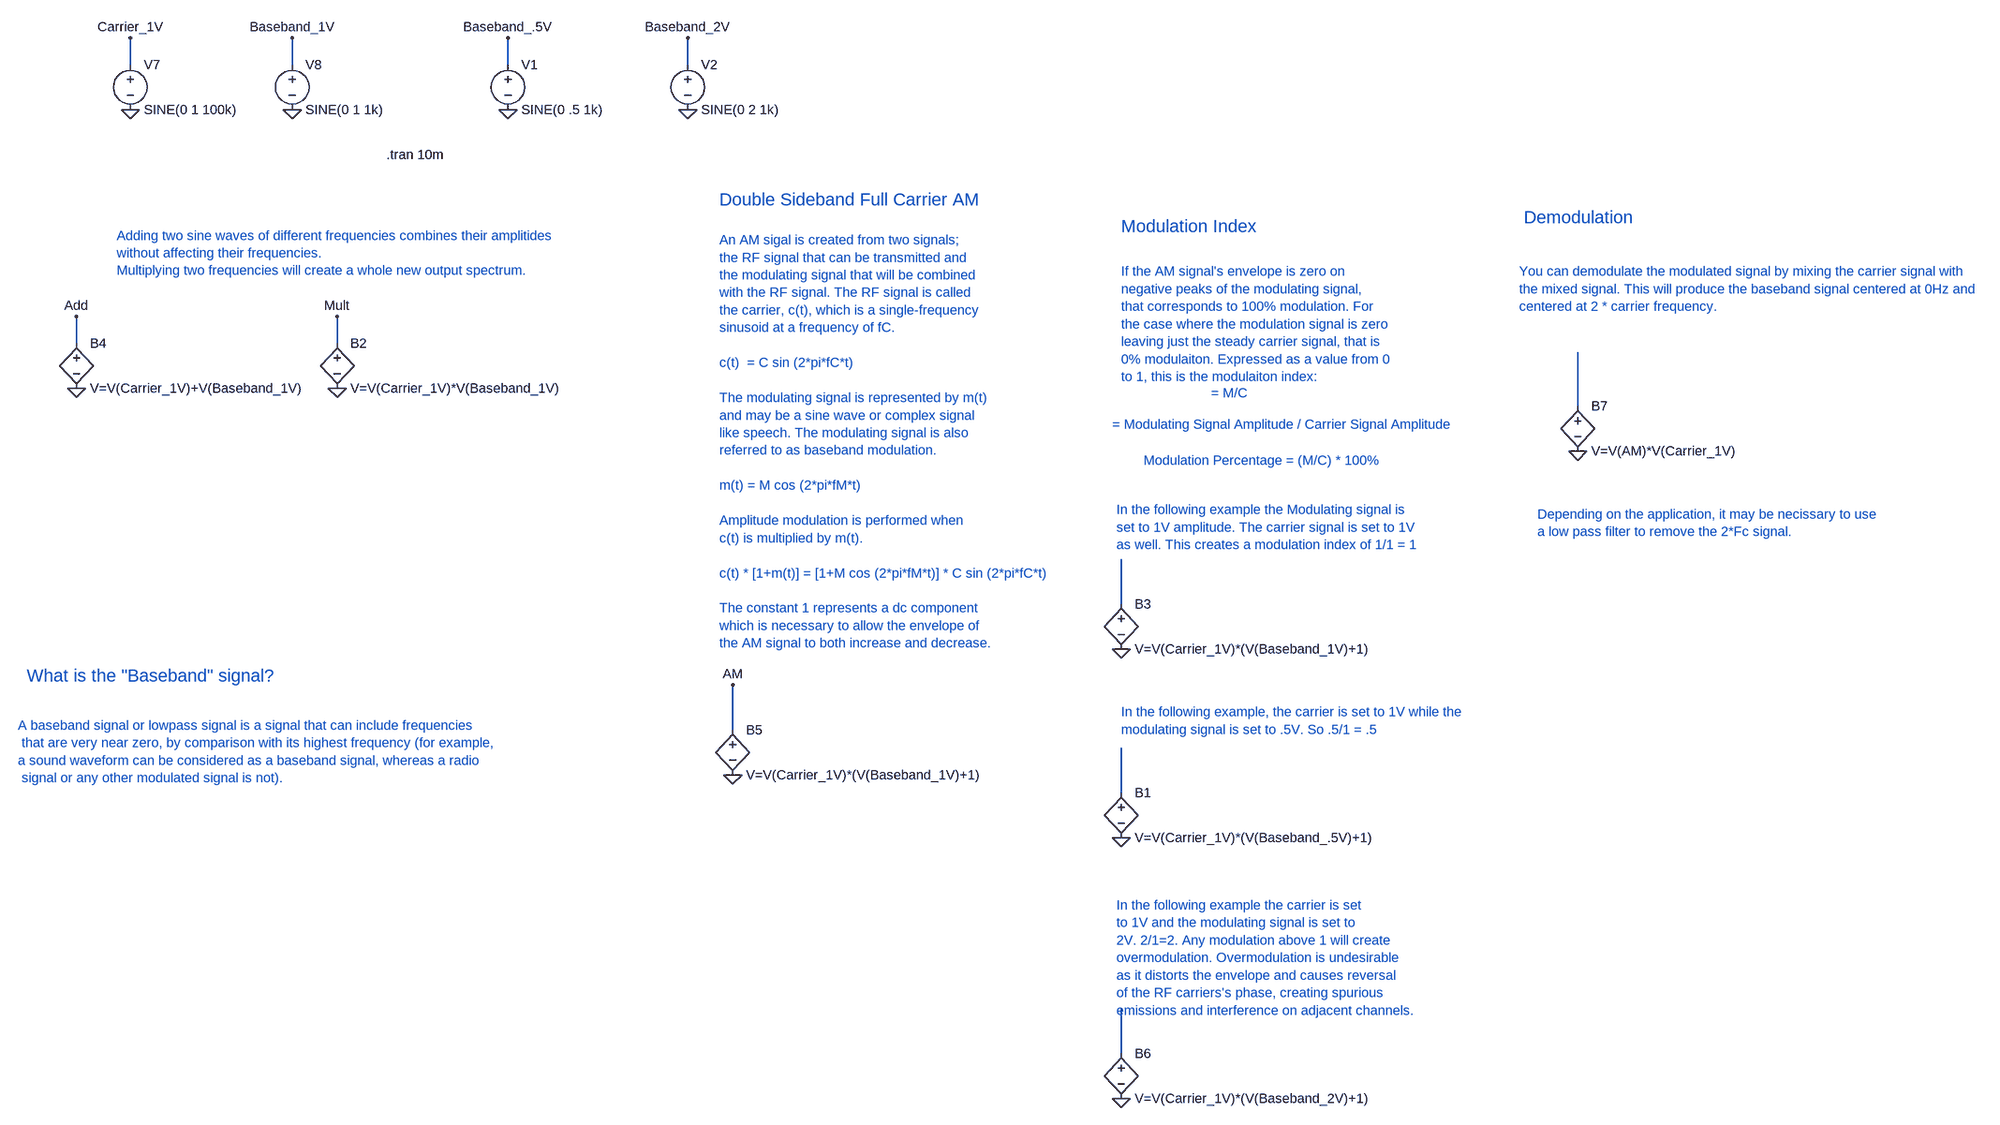
[diagram p0: schematic AmplitudeModulation.asc]
AmplitudeModulation.asc, the LTspice schematic file:
Version 4
SHEET 1 2204 1380
WIRE -1952 -1040 -1952 -1088
WIRE -1664 -1040 -1664 -1088
WIRE -1280 -1040 -1280 -1088
WIRE -960 -1040 -960 -1088
WIRE -2048 -544 -2048 -592
WIRE -1584 -544 -1584 -592
WIRE 1184 -432 1184 -528
WIRE 128 -80 128 -160
WIRE -880 144 -880 64
WIRE 128 256 128 176
WIRE 128 720 128 640
FLAG -1952 -960 0
FLAG -1664 -960 0
FLAG -2048 -464 0
FLAG -1952 -1088 Carrier_1V
FLAG -1664 -1088 Baseband_1V
FLAG -2048 -592 Add
FLAG -880 224 0
FLAG 128 336 0
FLAG -1584 -464 0
FLAG -1584 -592 Mult
FLAG -1280 -960 0
FLAG -1280 -1088 Baseband_.5V
FLAG 128 0 0
FLAG -960 -960 0
FLAG -960 -1088 Baseband_2V
FLAG 128 800 0
FLAG 1184 -352 0
FLAG -880 64 AM
SYMBOL voltage -1952 -1056 R0
WINDOW 123 0 0 Left 0
WINDOW 39 0 0 Left 0
SYMATTR InstName V7
SYMATTR Value SINE(0 1 100k)
SYMBOL voltage -1664 -1056 R0
WINDOW 123 0 0 Left 0
WINDOW 39 0 0 Left 0
SYMATTR InstName V8
SYMATTR Value SINE(0 1 1k)
SYMBOL bv -2048 -560 R0
SYMATTR InstName B4
SYMATTR Value V=V(Carrier_1V)+V(Baseband_1V)
SYMBOL bv -880 128 R0
SYMATTR InstName B5
SYMATTR Value V=V(Carrier_1V)*(V(Baseband_1V)+1)
SYMBOL bv 128 240 R0
SYMATTR InstName B1
SYMATTR Value V=V(Carrier_1V)*(V(Baseband_.5V)+1)
SYMBOL bv -1584 -560 R0
SYMATTR InstName B2
SYMATTR Value V=V(Carrier_1V)*V(Baseband_1V)
SYMBOL voltage -1280 -1056 R0
WINDOW 123 0 0 Left 0
WINDOW 39 0 0 Left 0
SYMATTR InstName V1
SYMATTR Value SINE(0 .5 1k)
SYMBOL bv 128 -96 R0
SYMATTR InstName B3
SYMATTR Value V=V(Carrier_1V)*(V(Baseband_1V)+1)
SYMBOL voltage -960 -1056 R0
WINDOW 123 0 0 Left 0
WINDOW 39 0 0 Left 0
SYMATTR InstName V2
SYMATTR Value SINE(0 2 1k)
SYMBOL bv 128 704 R0
SYMATTR InstName B6
SYMATTR Value V=V(Carrier_1V)*(V(Baseband_2V)+1)
SYMBOL bv 1184 -448 R0
SYMATTR InstName B7
SYMATTR Value V=V(AM)*V(Carrier_1V)
TEXT -1496 -880 Left 2 !.tran 10m
TEXT -1976 -736 Left 2 ;Adding two sine waves of different frequencies combines their amplitides\nwithout affecting their frequencies.\nMultiplying two frequencies will create a whole new output spectrum.
TEXT -904 -728 Left 2 ;An AM sigal is created from two signals;\nthe RF signal that can be transmitted and\nthe modulating signal that will be combined\nwith the RF signal. The RF signal is called \nthe carrier, c(t), which is a single-frequency\nsinusoid at a frequency of fC.\n \nc(t)  = C sin (2*pi*fC*t)\n \nThe modulating signal is represented by m(t)\nand may be a sine wave or complex signal\nlike speech. The modulating signal is also\nreferred to as baseband modulation.\n \nm(t) = M cos (2*pi*fM*t)\n \nAmplitude modulation is performed when\nc(t) is multiplied by m(t).\n \nc(t) * [1+m(t)] = [1+M cos (2*pi*fM*t)] * C sin (2*pi*fC*t)\n \nThe constant 1 represents a dc component\nwhich is necessary to allow the envelope of\nthe AM signal to both increase and decrease.
TEXT 128 -672 Left 2 ;If the AM signal's envelope is zero on\nnegative peaks of the modulating signal,\nthat corresponds to 100% modulation. For\nthe case where the modulation signal is zero\nleaving just the steady carrier signal, that is\n0% modulaiton. Expressed as a value from 0\nto 1, this is the modulaiton index:
TEXT 288 -456 Left 2 ;= M/C
TEXT 168 -336 Left 2 ;Modulation Percentage = (M/C) * 100%
TEXT 112 -400 Left 2 ;= Modulating Signal Amplitude / Carrier Signal Amplitude
TEXT 120 -248 Left 2 ;In the following example the Modulating signal is\nset to 1V amplitude. The carrier signal is set to 1V\nas well. This creates a modulation index of 1/1 = 1
TEXT 128 112 Left 2 ;In the following example, the carrier is set to 1V while the\nmodulating signal is set to .5V. So .5/1 = .5
TEXT 120 456 Left 2 ;In the following example the carrier is set\nto 1V and the modulating signal is set to\n2V. 2/1=2. Any modulation above 1 will create\novermodulation. Overmodulation is undesirable\nas it distorts the envelope and causes reversal\nof the RF carriers's phase, creating spurious\nemissions and interference on adjacent channels.
TEXT 128 -752 Left 3 ;Modulation Index
TEXT -904 -800 Left 3 ;Double Sideband Full Carrier AM
TEXT 1080 -672 Left 2 ;You can demodulate the modulated signal by mixing the carrier signal with\nthe mixed signal. This will produce the baseband signal centered at 0Hz and \ncentered at 2 * carrier frequency.
TEXT 1088 -768 Left 3 ;Demodulation
TEXT -2152 136 Left 2 ;A baseband signal or lowpass signal is a signal that can include frequencies\n that are very near zero, by comparison with its highest frequency (for example, \na sound waveform can be considered as a baseband signal, whereas a radio\n signal or any other modulated signal is not).
TEXT -2136 48 Left 3 ;What is the "Baseband" signal?
TEXT 1112 -240 Left 2 ;Depending on the application, it may be necissary to use\na low pass filter to remove the 2*Fc signal.

The netlist it stands for:
* AmplitudeModulation.asc
V7 Carrier_1V 0 SINE(0 1 100k)
V8 Baseband_1V 0 SINE(0 1 1k)
B4 Add 0 V=V(Carrier_1V)+V(Baseband_1V)
B5 AM 0 V=V(Carrier_1V)*(V(Baseband_1V)+1)
B1 N003 0 V=V(Carrier_1V)*(V(Baseband_.5V)+1)
B2 Mult 0 V=V(Carrier_1V)*V(Baseband_1V)
V1 Baseband_.5V 0 SINE(0 .5 1k)
B3 N002 0 V=V(Carrier_1V)*(V(Baseband_1V)+1)
V2 Baseband_2V 0 SINE(0 2 1k)
B6 N004 0 V=V(Carrier_1V)*(V(Baseband_2V)+1)
B7 N001 0 V=V(AM)*V(Carrier_1V)
.tran 10m
* Adding two sine waves of different frequencies combines their amplitides
* without affecting their frequencies.
* Multiplying two frequencies will create a whole new output spectrum.
* An AM sigal is created from two signals;
* the RF signal that can be transmitted and
* the modulating signal that will be combined
* with the RF signal. The RF signal is called
* the carrier, c(t), which is a single-frequency
* sinusoid at a frequency of fC.
* c(t)  = C sin (2*pi*fC*t)
* The modulating signal is represented by m(t)
* and may be a sine wave or complex signal
* like speech. The modulating signal is also
* referred to as baseband modulation.
* m(t) = M cos (2*pi*fM*t)
* Amplitude modulation is performed when
* c(t) is multiplied by m(t).
* c(t) * [1+m(t)] = [1+M cos (2*pi*fM*t)] * C sin (2*pi*fC*t)
* The constant 1 represents a dc component
* which is necessary to allow the envelope of
* the AM signal to both increase and decrease.
* If the AM signal's envelope is zero on
* negative peaks of the modulating signal,
* that corresponds to 100% modulation. For
* the case where the modulation signal is zero
* leaving just the steady carrier signal, that is
* 0% modulaiton. Expressed as a value from 0
* to 1, this is the modulaiton index:
* = M/C
* Modulation Percentage = (M/C) * 100%
* = Modulating Signal Amplitude / Carrier Signal Amplitude
* In the following example the Modulating signal is
* set to 1V amplitude. The carrier signal is set to 1V
* as well. This creates a modulation index of 1/1 = 1
* In the following example, the carrier is set to 1V while the
* modulating signal is set to .5V. So .5/1 = .5
* In the following example the carrier is set
* to 1V and the modulating signal is set to
* 2V. 2/1=2. Any modulation above 1 will create
* overmodulation. Overmodulation is undesirable
* as it distorts the envelope and causes reversal
* of the RF carriers's phase, creating spurious
* emissions and interference on adjacent channels.
* Modulation Index
* Double Sideband Full Carrier AM
* You can demodulate the modulated signal by mixing the carrier signal with
* the mixed signal. This will produce the baseband signal centered at 0Hz and
* centered at 2 * carrier frequency.
* Demodulation
* A baseband signal or lowpass signal is a signal that can include frequencies
*  that are very near zero, by comparison with its highest frequency (for example,
* a sound waveform can be considered as a baseband signal, whereas a radio
*  signal or any other modulated signal is not).
* What is the "Baseband" signal?
* Depending on the application, it may be necissary to use
* a low pass filter to remove the 2*Fc signal.
.backanno
.end